# EAGLE design ArduPilotMegaShield_H_v11_filterjumpers (EAGLE 5.11)
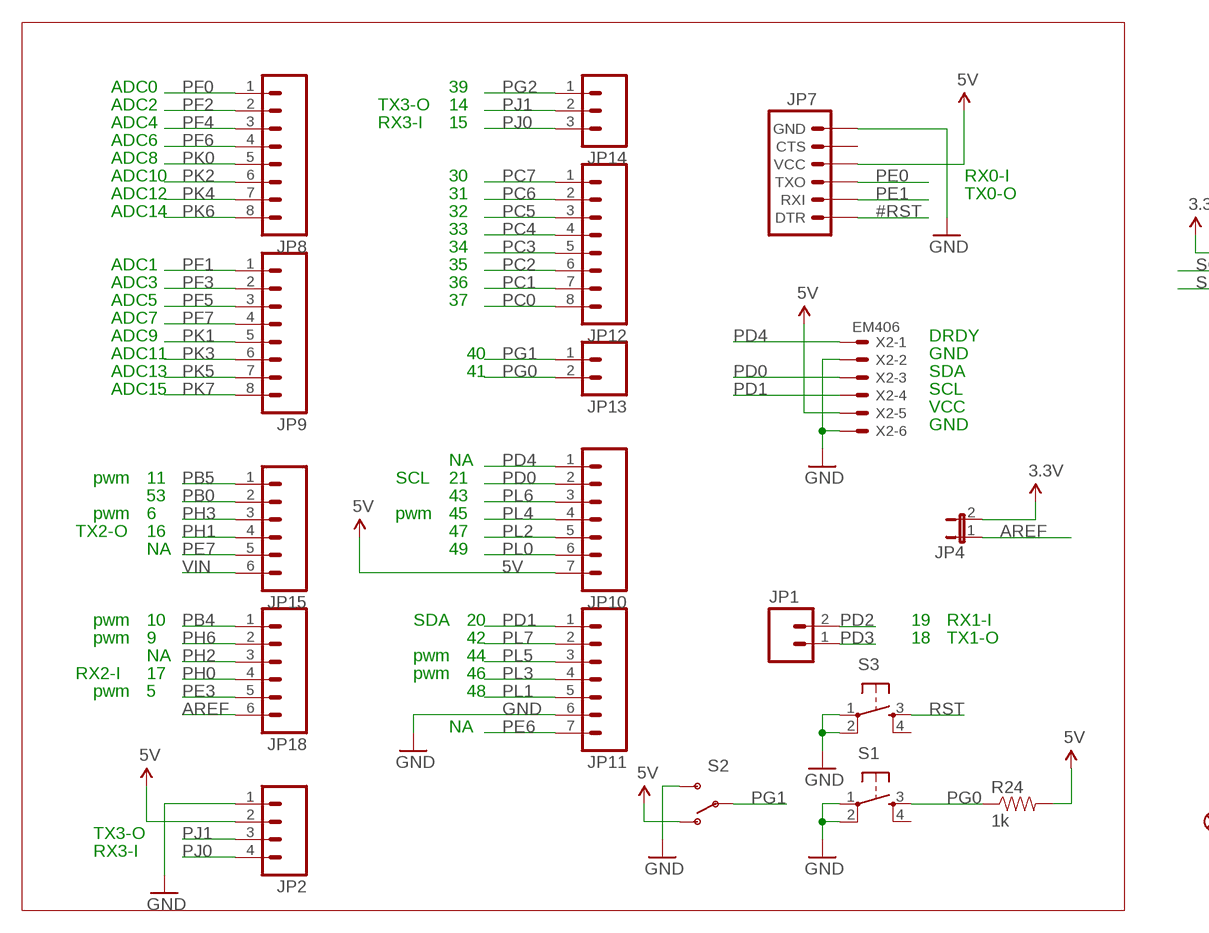
[diagram p0: schematic, sheet 1, part 1 of 2]
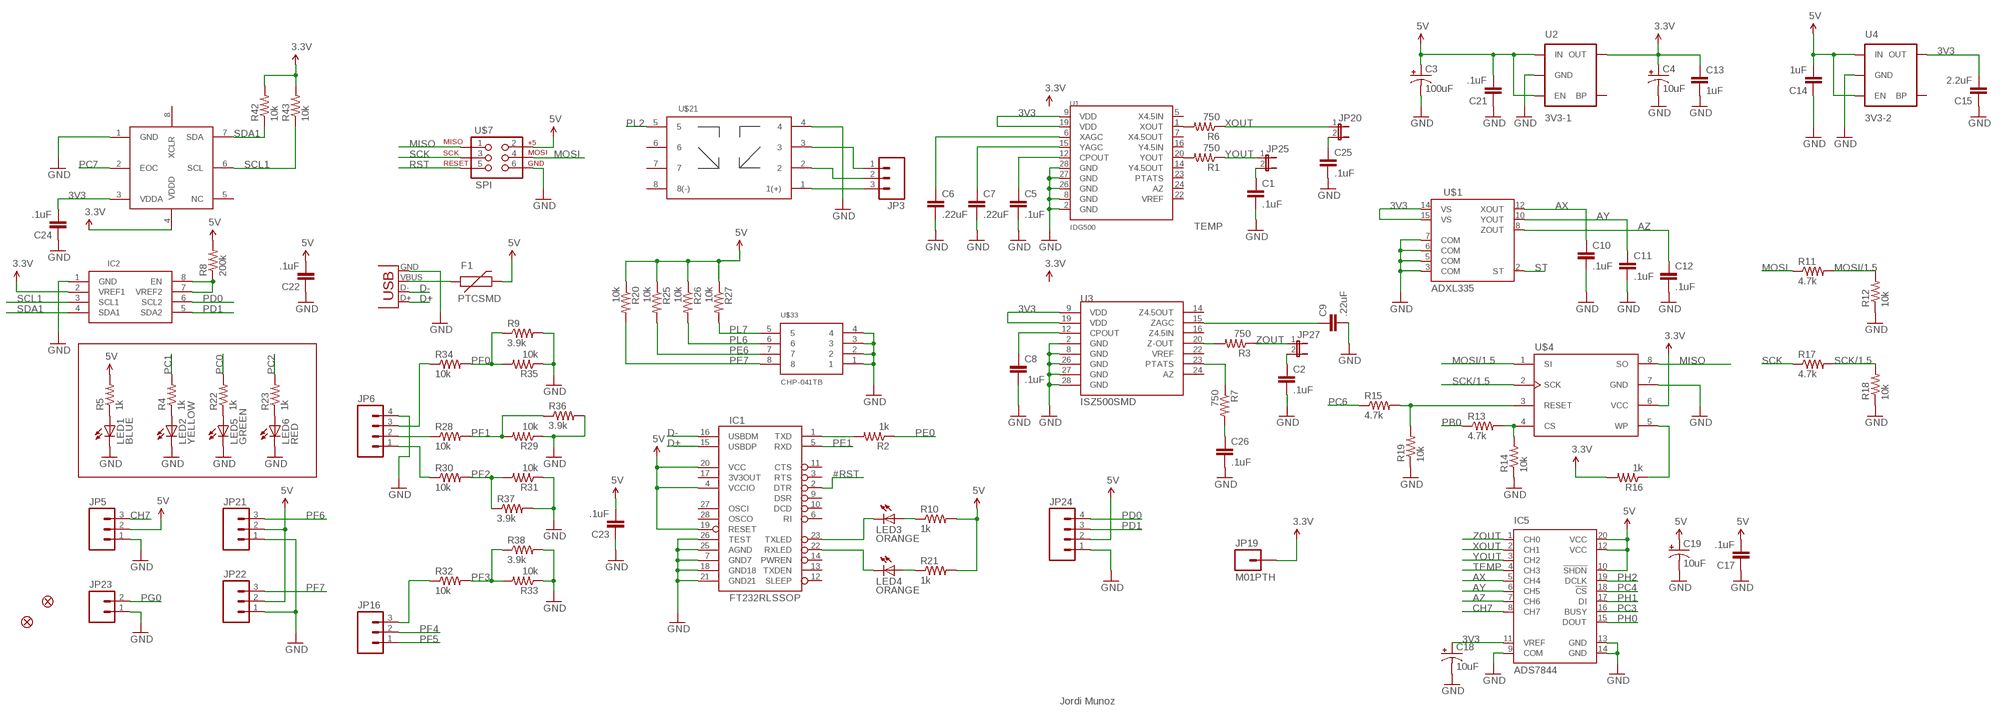
[diagram p1: schematic, sheet 1, part 2 of 2]

## Parts
C1  .1uF  CAP0402  [C0402]
C2  .1uF  CAP0402  [C0402]
C3  100uF  CAP_POL3528  [EIA3528]
C4  10uF  CAP_POL1206  [EIA3216]
C5  .1uF  CAP0402  [C0402]
C6  .22uF  CAP0402  [C0402]
C7  .22uF  CAP0402  [C0402]
C8  .1uF  CAP0402  [C0402]
C9  .22uF  CAP0402  [C0402]
C10  .1uF  CAP0402  [C0402]
C11  .1uF  CAP0402  [C0402]
C12  .1uF  CAP0402  [C0402]
C13  1uF  CAP0402  [C0402]
C14  1uF  CAP0402  [C0402]
C15  2.2uF  CAP0402  [C0402]
C17  .1uF  CAP0402  [C0402]
C18  10uF  CAP_POL1206  [EIA3216]
C19  10uF  CAP_POL1206  [EIA3216]
C21  .1uF  CAP0402  [C0402]
C22  .1uF  CAP0402  [C0402]
C23  .1uF  CAP0402  [C0402]
C24  .1uF  CAP0402  [C0402]
C25  .1uF  CAP0402  [C0402]
C26  .1uF  CAP0402  [C0402]
F1  PTCSMD  [PTC-1206]
IC1  FT232RLSSOP  [SSOP28DB]
IC2  PCA9306  [SOIC8]
IC5  ADS7844  ADS8344U  [SSOP20BU]
JP1  M02PTH  [1X02]
JP2  M04PTH  [1X04]
JP3  M03PTH  [1X03]
JP4  JUMPER-2SMD-NO  [SJ_2S-NO]
JP5  M03PTH  [1X03]
JP6  M04PTH  [1X04]
JP7  ARDUINO_SERIAL_PROGRAMPTH  [1X06]
JP8  M08  [1X08]
JP9  M08  [1X08]
JP10  M07  [1X07]
JP11  M07  [1X07]
JP12  M08  [1X08]
JP13  M02PTH  [1X02]
JP14  M03PTH  [1X03]
JP15  M06SIP  [1X06]
JP16  M03PTH  [1X03]
JP17  FIDUCIAL1X2.5  [FIDUCIAL-1X2.5]
JP18  M06SIP  [1X06]
JP19  M01PTH  [1X01]
JP20  JUMPER-2SMD-NO  [SJ_2S-NO]
JP21  M03PTH  [1X03]
JP22  M03PTH  [1X03]
JP23  M02PTH  [1X02]
JP24  M04PTH  [1X04]
JP25  JUMPER-2SMD-NO  [SJ_2S-NO]
JP26  FIDUCIAL1X2.5  [FIDUCIAL-1X2.5]
JP27  JUMPER-2SMD-NO  [SJ_2S-NO]
LED1  BLUE  LED0603  [LED-0603]
LED2  YELLOW  LED0603  [LED-0603]
LED3  ORANGE  LED0603  [LED-0603]
LED4  ORANGE  LED0603  [LED-0603]
LED5  GREEN  LED0603  [LED-0603]
LED6  RED  LED0603  [LED-0603]
R1  750  RESISTOR0402  [C0402]
R2  1k  RESISTOR0402  [C0402]
R3  750  RESISTOR0402  [C0402]
R4  1k  RESISTOR0402  [C0402]
R5  1k  RESISTOR0402  [C0402]
R6  750  RESISTOR0402  [C0402]
R7  750  RESISTOR0402  [C0402]
R8  200k  RESISTOR0402  [C0402]
R9  3.9k  RESISTOR0402  [C0402]
R10  1k  RESISTOR0402  [C0402]
R11  4.7k  RESISTOR0402  [C0402]
R12  10k  RESISTOR0402  [C0402]
R13  4.7k  RESISTOR0402  [C0402]
R14  10k  RESISTOR0402  [C0402]
R15  4.7k  RESISTOR0402  [C0402]
R16  1k  RESISTOR0402  [C0402]
R17  4.7k  RESISTOR0402  [C0402]
R18  10k  RESISTOR0402  [C0402]
R19  10k  RESISTOR0402  [C0402]
R20  10k  RESISTOR0402  [C0402]
R21  1k  RESISTOR0402  [C0402]
R22  1k  RESISTOR0402  [C0402]
R23  1k  RESISTOR0402  [C0402]
R24  1k  RESISTOR0402  [C0402]
R25  10k  RESISTOR0402  [C0402]
R26  10k  RESISTOR0402  [C0402]
R27  10k  RESISTOR0402  [C0402]
R28  10k  RESISTOR0402  [C0402]
R29  10k  RESISTORPTH1  [AXIAL-0.3]
R30  10k  RESISTOR0402  [C0402]
R31  10k  RESISTORPTH1  [AXIAL-0.3]
R32  10k  RESISTOR0402  [C0402]
R33  10k  RESISTORPTH1  [AXIAL-0.3]
R34  10k  RESISTOR0402  [C0402]
R35  10k  RESISTORPTH1  [AXIAL-0.3]
R36  3.9k  RESISTOR0402  [C0402]
R37  3.9k  RESISTOR0402  [C0402]
R38  3.9k  RESISTOR0402  [C0402]
R42  10k  RESISTOR0402  [C0402]
R43  10k  RESISTOR0402  [C0402]
S1  TAC_SWITCHSMD  [TACTILE_SWITCH_SMD]
S2  SWITCH-SPSTSMD2  [SWITCH-SPDT-SMD]
S3  TAC_SWITCHSMD  [TACTILE_SWITCH_SMD]
U1  IDG500  [QFN-28_6X8]
U2  3V3-1  V_REG_LDOSMD  [SOT23-5]
U3  ISZ500SMD  [QFN-28_6X8]
U4  3V3-2  V_REG_LDOSMD  [SOT23-5]
U$1  ADXL335  ADXL330SMD  [LFCSP-16]
U$4  DF  ATMEL_DATA_FLASH  [SO08WIDE]
U$7  SPI  AVR_SPI_PRG_6NS  [2X3-NS]
U$8  BMP085  [BMP085]
U$21  RELAY_23  [RELAY_23]
U$33  CHP-041TB  [CHP-041TB]
X1  USBSMD  [USB-MINIB]
X2  EM406  SM06B-SRSS-TB  [SM06B-SRSS-TB]

## Nets
3.3V: C4.A(+) C13.1 IC2.2(VREF1) JP4.2 JP19.1 R16.2 R42.2 R43.2 U2.5(OUT) U$4.6(VCC) U$8.4(VDDD)
3V3: C15.2 C18.A(+) C24.2 IC5.11(VREF) U1.9(VDD) U1.19(VDD) U3.9(VDD) U3.19(VDD) U4.5(OUT) U$1.14(VS) U$1.15(VS) U$8.3(VDDA)
5V: C3.A(+) C14.2 C17.2 C19.A(+) C21.2 C22.2 C23.2 F1.2 IC1.4(VCCIO) IC1.19(RESET) IC1.20(VCC) IC5.10(!SHDN) IC5.12(VCC) IC5.20(VCC) JP2.2 JP5.2 JP7.4(VCC) JP10.7 JP21.2 JP22.2 JP24.2 R5.2 R8.2 R10.2 R20.1 R21.2 R24.2 R25.1 R26.1 R27.1 S2.1(O) U2.1(IN) U2.3(EN) U4.1(IN) U4.3(EN) U$7.2 X2.5
#RST: IC1.2(DTR) JP7.1(DTR)
AREF: JP4.1 JP18.6
AX: C10.1 IC5.5(CH4) U$1.12(XOUT)
AY: C11.1 IC5.6(CH5) U$1.10(YOUT)
AZ: C12.1 IC5.7(CH6) U$1.8(ZOUT)
CH7: IC5.8(CH7) JP5.3
D+: IC1.15(USBDP) X1.D+
D-: IC1.16(USBDM) X1.D-
GND: C1.2 C2.2 C3.C(-) C4.C(-) C5.2 C6.2 C7.2 C8.2 C9.2 C10.2 C11.2 C12.2 C13.2 C14.1 C15.1 C17.1 C18.C(-) C19.C(-) C21.1 C22.1 C23.1 C24.1 C25.2 C26.2 IC1.7(GND7) IC1.18(GND18) IC1.21(GND21) IC1.25(AGND) IC1.26(TEST) IC2.1(GND) IC5.9(COM) IC5.13(GND) IC5.14(GND) JP2.1 JP5.1 JP6.4 JP7.6(GND) JP11.6 JP21.1 JP22.1 JP23.1 JP24.1 LED1.C LED2.C LED5.C LED6.C R9.2 R12.1 R14.1 R18.1 R19.1 R29.P$1 R31.P$1 R33.P$1 R35.P$1 R36.2 R37.2 R38.2 S1.1 S1.2 S2.3(S) S3.1 S3.2 U1.2(GND) U1.8(GND) U1.26(GND) U1.27(GND) U1.28(GND) U2.2(GND) U3.2(GND) U3.8(GND) U3.26(GND) U3.27(GND) U3.28(GND) U4.2(GND) U$1.3(COM) U$1.5(COM) U$1.6(COM) U$1.7(COM) U$4.7(GND) U$7.6 U$8.1(GND) U$21.4 U$33.1 U$33.2 U$33.3 U$33.4 X1.GND X2.2 X2.6
MISO: U$4.8(SO) U$7.1
MOSI: R11.1 U$7.4
MOSI/1.5: R11.2 R12.2 U$4.1(SI)
N$1: LED1.A R5.1
N$2: LED2.A R4.1
N$3: C8.1 U3.12(CPOUT)
N$4: C9.1 U3.15(ZAGC)
N$5: LED3.A R10.1
N$6: IC1.1(TXD) R2.2
N$7: R15.2 R19.2 U$4.3(RESET)
N$8: R3.2 U3.20(Z-OUT)
N$9: R7.1 U3.23(PTATS)
N$10: IC2.7(VREF2) IC2.8(EN) R8.1
N$11: JP3.1 U$21.3
N$12: R1.2 U1.20(YOUT)
N$13: C6.1 U1.6(XAGC)
N$14: R13.2 R14.2 U$4.4(CS)
N$15: R6.2 U1.1(XOUT)
N$16: C5.1 U1.12(CPOUT)
N$17: F1.1 X1.VBUS
N$18: C7.1 U1.15(YAGC)
N$20: C2.1 JP27.2
N$21: JP3.2 U$21.2
N$22: LED4.A R21.1
N$23: C25.1 JP20.2
N$24: IC1.23(TXLED) LED3.C
N$25: IC1.22(RXLED) LED4.C
N$26: LED5.A R22.1
N$27: LED6.A R23.1
N$28: JP3.3 U$21.1(1(+))
N$29: C1.1 JP25.2
N$34: JP6.2 R28.1
N$36: JP6.1 R30.1
N$38: JP16.3 R32.1
N$40: JP6.3 R34.1
PB0: JP15.2 R13.1
PB4: JP18.1
PB5: JP15.1
PC0: JP12.8 R22.2
PC1: JP12.7 R4.2
PC2: JP12.6 R23.2
PC3: IC5.16(BUSY) JP12.5
PC4: IC5.18(!CS) JP12.4
PC5: JP12.3
PC6: JP12.2 R15.1
PC7: JP12.1 U$8.2(EOC)
PD0: IC2.6(SCL2) JP10.2 JP24.4 X2.3
PD1: IC2.5(SDA2) JP11.1 JP24.3 X2.4
PD2: JP1.2
PD3: JP1.1
PD4: JP10.1 X2.1
PE0: JP7.3(TXO) R2.1
PE1: IC1.5(RXD) JP7.2(RXI)
PE3: JP18.5
PE6: JP11.7 R25.2 U$33.7
PE7: JP15.5 R20.2 U$33.8
PF0: JP8.1 R9.1 R34.2 R35.P$2
PF1: JP9.1 R28.2 R29.P$2 R36.1
PF2: JP8.2 R30.2 R31.P$2 R37.1
PF3: JP9.2 R32.2 R33.P$2 R38.1
PF4: JP8.3 JP16.2
PF5: JP9.3 JP16.1
PF6: JP8.4 JP21.3
PF7: JP9.4 JP22.3
PG0: JP13.2 JP23.2 R24.1 S1.3
PG1: JP13.1 S2.2(P)
PG2: JP14.1
PH0: IC5.15(DOUT) JP18.4
PH1: IC5.17(DI) JP15.4
PH2: IC5.19(DCLK) JP18.3
PH3: JP15.3
PH6: JP18.2
PJ0: JP2.4 JP14.3
PJ1: JP2.3 JP14.2
PK0: JP8.5
PK1: JP9.5
PK2: JP8.6
PK3: JP9.6
PK4: JP8.7
PK5: JP9.7
PK6: JP8.8
PK7: JP9.8
PL0: JP10.6
PL1: JP11.5
PL2: JP10.5 U$21.5
PL3: JP11.4
PL4: JP10.4
PL5: JP11.3
PL6: JP10.3 R26.2 U$33.6
PL7: JP11.2 R27.2 U$33.5
RST: S3.3 U$7.5
SCK: R17.1 U$7.3
SCK/1.5: R17.2 R18.2 U$4.2(SCK)
SCL1: IC2.3(SCL1) R43.1 U$8.6(SCL)
SDA1: IC2.4(SDA1) R42.1 U$8.7(SDA)
ST: U$1.2(ST)
TEMP: C26.1 IC5.4(CH3) R7.2
VIN: JP15.6
WP: R16.1 U$4.5(WP)
XOUT: IC5.2(CH1) JP20.1 R6.1
YOUT: IC5.3(CH2) JP25.1 R1.1
ZOUT: IC5.1(CH0) JP27.1 R3.1
Unconnected: IC1.3(RTS) IC1.6(RI) IC1.9(DSR) IC1.10(DCD) IC1.11(CTS) IC1.12(SLEEP) IC1.13(TXDEN) IC1.14(PWREN) IC1.17(3V3OUT) IC1.27(OSCI) IC1.28(OSCO) JP7.5(CTS) S1.4 S3.4 U1.5(X4.5IN) U1.7(X4.5OUT) U1.14(Y4.5OUT) U1.16(Y4.5IN) U1.22(VREF) U1.23(PTATS) U1.24(AZ) U2.4(BP) U3.14(Z4.5OUT) U3.16(Z4.5IN) U3.22(VREF) U3.24(AZ) U4.4(BP) U$8.5(NC) U$8.8(XCLR) U$21.6 U$21.7

## Notes on the sheet
- ADC0 | 39
- ADC2 | TX3-O | 14
- ADC4 | RX3-I | 15
- ADC6
- ADC8
- ADC10 | 30 | RX0-I
- ADC12 | 31 | TX0-O
- ADC14 | 32
- 33
- 34
- ADC1 | 35
- ADC3 | 36
- ADC5 | 37
- ADC7
- ADC9 | DRDY
- ADC11 | 40 | GND
- ADC13 | 41 | SDA
- ADC15 | SCL
- VCC
- GND
- NA
- pwm | 11 | SCL | 21
- 53 | 43
- pwm | 6 | pwm | 45
- TX2-O | 16 | 47
- NA | 49
- pwm | 10 | SDA | 20 | 19 | RX1-I
- pwm | 9 | 42 | 18 | TX1-O
- NA | pwm | 44
- RX2-I | 17 | pwm | 46
- pwm | 5 | 48
- NA
- TX3-O
- RX3-I
- Jordi Munoz

## Power pins joined to a net without a drawn wire
8(-): U$21.8(8(-))

## Library data of the parts
C1 C2 C5-C15 C17 C21-C26 = DIYdrones3:CAP: Capacitor Standard 0603 ceramic capacitor, and 0.1" leaded capacitor.
C3 C4 C18 C19 = DIYdrones3:CAP_POL: Capacitor Polarized These are standard SMD and PTH capacitors. Normally 10uF, 47uF, and 100uF in electrolytic and tantalum varieties. Always verify the external diameter of the through hole cap, it varies with capacity, voltage, and manufacturer. The EIA devices should be standard.
F1 = DIYdrones3:PTC: Resettable Fuse PTC Resettable Fuse. Spark Fun Electronics SKU : COM-08357
IC1 = SparkFun:FT232RL: USB UART FT232RL 4th Generation USB UART (USB <-> Serial) Controller. Spark Fun Electronics SKU : COM-00650
IC2 = DIYdrones:PCA9306: I2C Level translator. Digi-Key part: 568-4215-1-ND By Jordi Munoz
IC5 = burr-brown:ADS8344: 16-Bit, 8-Channel Serial Output Sampling ADC
JP1 JP13 JP23 = DIYdrones3:M02: Header 2 Standard 2-pin 0.1" header. Use with straight break away headers (SKU : PRT-00116), right angle break away headers (PRT-00553), swiss pins (PRT-00743), machine pins (PRT-00117), and female headers (PRT-00115). Molex polarized connector foot print use with SKU : PRT-08233 with associated crimp pins and housings.
JP2 JP6 JP24 = DIYdrones3:M04: Header 4 Standard 4-pin 0.1" header. Use with straight break away headers (SKU : PRT-00116), right angle break away headers (PRT-00553), swiss pins (PRT-00743), machine pins (PRT-00117), and female headers (PRT-00115). Molex polarized connector foot print use with SKU : PRT-08231 with associated crimp pins and housings.
JP3 JP5 JP14 JP16 JP21 JP22 = DIYdrones3:M03: Header 3 Standard 3-pin 0.1" header. Use with straight break away headers (SKU : PRT-00116), right angle break away headers (PRT-00553), swiss pins (PRT-00743), machine pins (PRT-00117), and female headers (PRT-00115). Molex polarized connector foot print use with SKU : PRT-08232 with associated crimp pins and housings.
JP4 JP20 JP25 JP27 = DIYdrones3:JUMPER-2: Jumper Basic 0.1" spaced jumper. Use with breakaway headers.
JP7 = DIYdrones3:ARDUINO_SERIAL_PROGRAM
JP8 JP9 JP12 = DIYdrones3:M08: Header 8 Standard 8-pin 0.1" header. Use with straight break away headers (SKU : PRT-00116), right angle break away headers (PRT-00553), swiss pins (PRT-00743), machine pins (PRT-00117), and female headers (PRT-00115).
JP10 JP11 = DIYdrones3:M07: Header 7 Standard 7-pin 0.1" header. Use with straight break away headers (SKU : PRT-00116), right angle break away headers (PRT-00553), swiss pins (PRT-00743), machine pins (PRT-00117), and female headers (PRT-00115). NOTES ON THE VARIANTS LOCK and LOCK_LONGPADS... This footprint was designed to help hold the alignment of a through-hole component (i.e. 7-pin header) while soldering it into place. You may notice that each hole has been shifted either up or down by 0.005 of an inch from it's more standard position (which is usually a perfectly straight line). This slight alteration caused the pins (the squares in the middle) to touch the edges of the holes. Because they are alternating, it causes a "brace" to hold the header in place. 0.005 has proven to be the perfect amount of "off-center" position when using our standard breakaway headers. Although looks a little odd when you look at the bare footprint, once you have a header in there, the alteration is very hard to notice. Also, if you push a header all the way into place, it is covered up entirely on the bottom side. This idea of altering the position of holes to aid alignment will be further integrated into the Sparkfun Library for other footprints. It can help hold any component with 3 or more connection pins.
JP15 JP18 = DIYdrones3:M06: Header 6 Standard 6-pin 0.1" header. Use with straight break away headers (SKU : PRT-00116), right angle break away headers (PRT-00553), swiss pins (PRT-00743), machine pins (PRT-00117), and female headers (PRT-00115). Molex polarized connector foot print use with SKU : PRT-08094 with associated crimp pins and housings. NOTES ON THE VARIANTS LOCK and LOCK_LONGPADS... This footprint was designed to help hold the alignment of a through-hole component (i.e. 6-pin header) while soldering it into place. You may notice that each hole has been shifted either up or down by 0.005 of an inch from it's more standard position (which is a perfectly straight line). This slight alteration caused the pins (the squares in the middle) to touch the edges of the holes. Because they are alternating, it causes a "brace" to hold the component in place. 0.005 has proven to be the perfect amount of "off-center" position when using our standard breakaway headers. Although looks a little odd when you look at the bare footprint, once you have a header in there, the alteration is very hard to notice. Also, if you push a header all the way into place, it is covered up entirely on the bottom side. This idea of altering the position of holes to aid alignment will be further integrated into the Sparkfun Library for other footprints. It can help hold any component with 3 or more connection pins.
JP17 JP26 = SparkFun:FIDUCIAL: Fiducial Alignment Points Various fiducial points for machine vision alignment.
JP19 = DIYdrones3:M01: Header 1 Standard 1-pin 0.1" header. Use with straight break away headers (SKU : PRT-00116), right angle break away headers (PRT-00553), swiss pins (PRT-00743), machine pins (PRT-00117), and female headers (PRT-00115).
LED1-LED6 = DIYdrones3:LED: LEDs Standard schematic elements and footprints for 5mm, 3mm, 1206, and 0603 sized LEDs. 5mm - Spark Fun Electronics SKU : COM-00529 (and others)
R1-R38 R42 R43 = DIYdrones3:RESISTOR: Resistor Basic schematic elements and footprints for 0603, 1206, and PTH 1/10th watt (small) resistors.
S1 S3 = DIYdrones3:TAC_SWITCH: Momentary Switch Button commonly used for reset or general input. Spark Fun Electronics SKU : COM-00097
S2 = SparkFun:SWITCH-SPST: SPST Switch Simple slide switch. Spark Fun Electronics SKU : COM-00102
U1 = DIYdrones_112210:IDG500
U2 U4 = SparkFun:V_REG_LDO: Voltage Regulator LDO Standard 150mA LDO voltage regulator in SOT-23 layout. Micrel part MIC5205. BP (by-pass) pin is used to lower output noise with 470pF cap.
U3 = DIYdrones_112210:ISZ500: ISZ500 Single axis gyro
U$1 = DIYdrones3:ADXL330: Triple Axis Accelerometer Analog Devices ADXL330 +/-3g 2.4V-5.25V Analog output. Spark Fun Electronics SKU : COM-00730. Center pad paste layer has been reduced to avoid shorting.
U$4 = DIYdrones3:ATMEL_DATA_FLASH: 16Mbit EEPROM DataFlash Footprint needs touching up. Spark Fun Electronics SKU : COM-00301
U$7 = DIYdrones3:AVR_SPI_PRG_6: AVR ISP 6 Pin This is the reduced ISP connector for AVR programming. Common on Arduino. This footprint will take up less PCB space and can be used with a 10-pin to 6-pin adapter such as SKU: BOB-08508
U$8 = SparkFun:BMP085
U$21 = DIYdrones:RELAY_23
U$33 = DIYdrones:CHP-041TB: By Jordi Munoz, for DIYDrones.com (3DRRobotics LLC).
X1 = DIYdrones3:USB: USB Connectors USB-B-PTH is fully proven SKU : PRT-00139 USB-miniB is fully proven SKU : PRT-00587 USB-A-PCB is untested. USB-A-H is throughly reviewed, but untested. Spark Fun Electronics SKU : PRT-00437 USB-B-SMT is throughly reviewed, but untested. Needs silkscreen touching up. USB-A-S has not been used/tested USB-MB-H has not been used/tested
X2 = con-jst2:?M06B-SRSS-TB: Disconnectable Crimp style connector, 1.0mm pitch 6 contacts

## Board
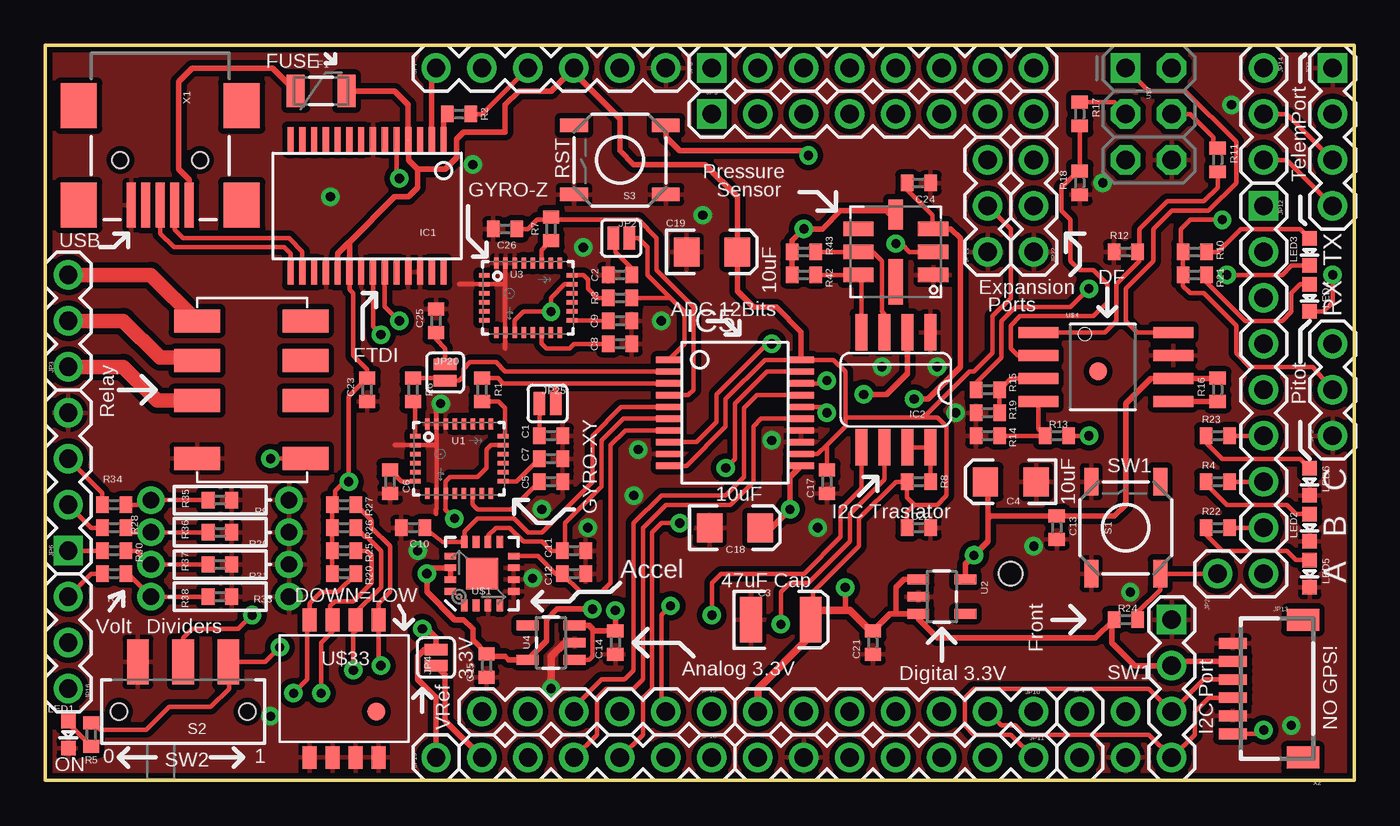
[diagram p2: board, top side]
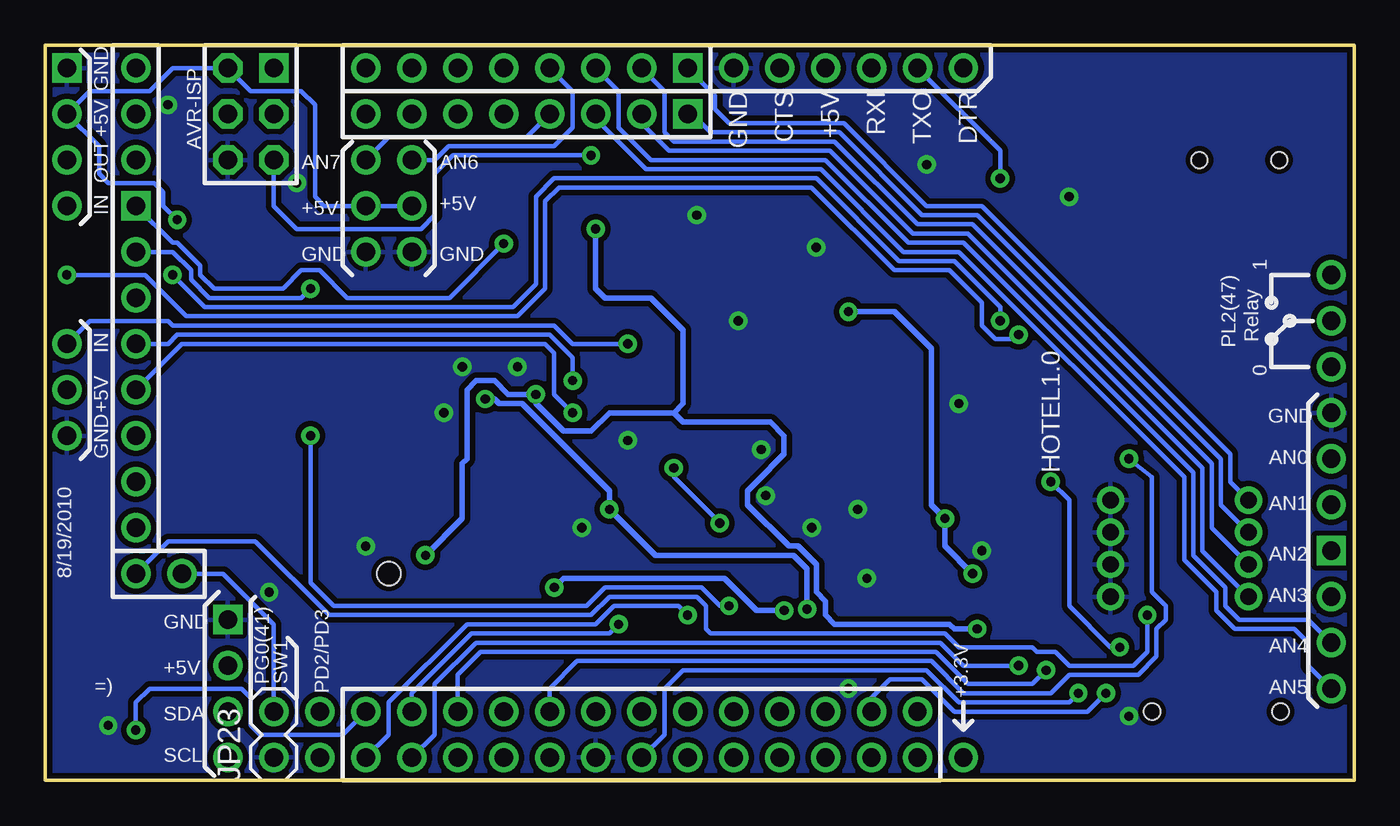
[diagram p3: board, bottom side, seen from below]

Size 72.31 x 40.63 mm. Coordinates in mm from the lower left corner, seen from the top.
Outline: 0,0 72.31,0 72.31,40.63 0,40.63 0,0
Copper layers (1*16): Top 0.035mm / dielectric 1.5mm / Bottom 0.035mm
Design rules "SparkFun": minimum track width 8mil, minimum drill 20mil, track to track 8mil, track to pad 8mil, pad to pad 8mil, via to via 8mil, smd to smd 8mil, copper to edge 10mil, drill to drill 8mil, minimum pad ring 12mil, minimum via ring 10mil, stop-mask expansion 4mil, vias tented up to drill 25mil, thermal gap 10mil
Holes 1.3 mm at 53.34,11.43

### Footprints (pad centres in the part's own frame; a part is rotated, then mirrored left to right if it is on the bottom)
C0402 = smd 0.7 x 0.9: 1 -0.65,0; 2 0.65,0
EIA3528 = smd 1.2 x 2.5: A 1.65,0; C -1.65,0
EIA3216 = smd 1.4 x 1.6: A 1.4,0; C -1.4,0
PTC-1206 = smd 1 x 1.8: 1 -1.4,0; 2 1.4,0
SSOP28DB = smd 0.348 x 1.397: 1 -4.225,-3.656; 2 -3.575,-3.656; 3 -2.925,-3.656; 4 -2.275,-3.656; 5 -1.625,-3.656; 6 -0.975,-3.656; 7 -0.325,-3.656; 8 0.325,-3.656; 9 0.975,-3.656; 10 1.625,-3.656; 11 2.275,-3.656; 12 2.925,-3.656; 13 3.575,-3.656; 14 4.225,-3.656; 15 4.225,3.656; 16 3.575,3.656; 17 2.925,3.656; 18 2.275,3.656; 19 1.625,3.656; 20 0.975,3.656; 21 0.325,3.656; 22 -0.325,3.656; 23 -0.975,3.656; 24 -1.625,3.656; 25 -2.275,3.656; 26 -2.925,3.656; 27 -3.575,3.656; 28 -4.225,3.656
SOIC8 = smd 0.66 x 2.032: 1 -1.905,-3.175; 2 -0.635,-3.175; 3 0.635,-3.175; 4 1.905,-3.175; 5 1.905,3.175; 6 0.635,3.175; 7 -0.635,3.175; 8 -1.905,3.175
SSOP20BU = smd 0.348 x 1.397: 1 -2.925,-3.656; 2 -2.275,-3.656; 3 -1.625,-3.656; 4 -0.975,-3.656; 5 -0.325,-3.656; 6 0.325,-3.656; 7 0.975,-3.656; 8 1.625,-3.656; 9 2.275,-3.656; 10 2.925,-3.656; 11 2.925,3.656; 12 2.275,3.656; 13 1.625,3.656; 14 0.975,3.656; 15 0.325,3.656; 16 -0.325,3.656; 17 -0.975,3.656; 18 -1.625,3.656; 19 -2.275,3.656; 20 -2.925,3.656
1X02 = drill 1.016 round: 1 0,0; 2 2.54,0
1X04 = drill 1.016 square: 1 0,0 | drill 1.016 round: 2 2.54,0; 3 5.08,0; 4 7.62,0
1X03 = drill 1.016 round: 1 0,0; 2 2.54,0; 3 5.08,0
SJ_2S-NO = smd 0.635 x 1.27: 1 0,0; 2 0.889,0
1X06 = drill 1.016 round: 1 0,0; 2 2.54,0; 3 5.08,0; 4 7.62,0; 5 10.16,0; 6 12.7,0
1X08 = drill 1.016 square: 1 0,0 | drill 1.016 round: 2 2.54,0; 3 5.08,0; 4 7.62,0; 5 10.16,0; 6 12.7,0; 7 15.24,0; 8 17.78,0
1X07 = drill 1.016 round: 1 0,0; 2 2.54,0; 3 5.08,0; 4 7.62,0; 5 10.16,0; 6 12.7,0; 7 15.24,0
FIDUCIAL-1X2.5 = smd 1 x 1: 1 0,0
1X01 = drill 1.016 round: 1 0,0
LED-0603 = smd 0.8 x 0.8: A 0,-0.75; C 0,0.75
AXIAL-0.3 = drill 0.9 round: P$1 -3.81,0; P$2 3.81,0
TACTILE_SWITCH_SMD = smd 1.524 x 0.762: 1 -2.54,1.905; 2 2.54,1.905; 3 -2.54,-1.905; 4 2.54,-1.905
SWITCH-SPDT-SMD = smd 1.2 x 2.5: 1 -2.5,-2.75; 2 0,-2.75; 3 2.5,-2.75 | hole 0.9: -3.55,0; 3.55,0
QFN-28_6X8 = smd 0.6 x 0.25: 1 -2.417,1.25; 2 -2.417,0.75; 3 -2.417,0.25; 4 -2.417,-0.25; 5 -2.417,-0.75; 6 -2.417,-1.25; 15 2.433,-1.25; 16 2.433,-0.75; 17 2.433,-0.25; 18 2.433,0.25; 19 2.433,0.75; 20 2.433,1.25 | smd 0.25 x 0.6: 7 -1.742,-1.925; 8 -1.242,-1.925; 9 -0.742,-1.925; 10 -0.242,-1.925; 11 0.258,-1.925; 12 0.758,-1.925; 13 1.258,-1.925; 14 1.758,-1.925; 21 1.758,1.925; 22 1.258,1.925; 23 0.758,1.925; 24 0.258,1.925; 25 -0.242,1.925; 26 -0.742,1.925; 27 -1.242,1.925; 28 -1.742,1.925
SOT23-5 = smd 0.55 x 1.2: 1 -0.95,-1.3; 2 0,-1.3; 3 0.95,-1.3; 4 0.95,1.3; 5 -0.95,1.3
LFCSP-16 = smd 1.75 x 1.75: 0 0,0 | smd 0.65 x 0.37: 1 -1.75,0.975; 2 -1.75,0.325; 3 -1.75,-0.325; 4 -1.75,-0.975; 9 1.75,-0.975; 10 1.75,-0.325; 11 1.75,0.325; 12 1.75,0.975 | smd 0.37 x 0.65: 5 -0.975,-1.75; 6 -0.325,-1.75; 7 0.325,-1.75; 8 0.975,-1.75; 13 0.975,1.75; 14 0.325,1.75; 15 -0.325,1.75; 16 -0.975,1.75
SO08WIDE = smd 0.61 x 2.21: 1 -1.905,-3.569; 2 -0.635,-3.569; 3 0.635,-3.569; 4 1.905,-3.569; 5 1.905,3.886; 6 0.635,3.886; 7 -0.635,3.886; 8 -1.905,3.886
2X3-NS = drill 1.016 square: 1 -2.54,-1.27 | drill 1.016 octagon: 2 -2.54,1.27; 3 0,-1.27; 4 0,1.27; 5 2.54,-1.27; 6 2.54,1.27
BMP085 = smd 1.67 x 0.8: 1 -2.065,1.27; 2 -2.065,0; 3 -2.065,-1.27; 5 2.065,-1.27; 6 2.065,0; 7 2.065,1.27 | smd 0.8 x 1.67: 4 0,-2.065 | smd 0.8 x 2.5: 8 0,1.65
RELAY_23 = smd 1.27 x 2.54: 1 3.806,3.048; 2 1.606,3.048; 3 -0.594,3.048; 4 -3.794,3.048; 5 -3.794,-2.952; 6 -0.594,-2.952; 7 1.606,-2.952; 8 3.806,-2.952
CHP-041TB = smd 0.76 x 1.27: 1 -1.905,-3.81; 2 -0.635,-3.81; 3 0.635,-3.81; 4 1.905,-3.81; 5 1.905,3.81; 6 0.635,3.81; 7 -0.635,3.81; 8 -1.905,3.81
USB-MINIB = smd 2.5 x 0.5: D+ 2.5,0; D- 2.5,0.8; GND 2.5,-1.6; ID 2.5,-0.8; VBUS 2.5,1.6 | smd 2.5 x 2: GND@1 -3,-4.5; GND@2 -3,4.5; GND@3 2.5,4.5; GND@4 2.5,-4.5 | hole 0.9: 0,2.2; 0,-2.2
SM06B-SRSS-TB = smd 0.6 x 1.55: 1 -2.5,2.975; 2 -1.5,2.975; 3 -0.5,2.975; 4 0.5,2.975; 5 1.5,2.975; 6 2.5,2.975 | smd 1.2 x 1.8: FIT@1 -3.8,-0.9; FIT@2 3.8,-0.9

### Placement (x,y rotation side)
C1  27.94,19.05 0 top
C2  31.75,27.94 180 top
C3  40.64,8.89 0 top
C4  53.34,16.51 180 top
C5  27.94,16.51 0 top
C6  19.05,16.51 270 top
C7  27.94,17.78 0 top
C8  31.75,24.13 0 top
C9  31.75,25.4 0 top
C10  20.32,13.97 180 top
C11  29.21,12.7 0 top
C12  29.21,11.43 0 top
C13  55.88,13.97 270 top
C14  31.5,7.62 90 top
C15  24.38,6.35 90 top
C17  43.18,16.51 90 top
C18  38.1,13.97 0 top
C19  36.83,29.21 0 top
C21  45.72,7.62 90 top
C22  48.26,13.97 180 top
C23  17.78,21.59 90 top
C24  48.26,33.02 180 top
C25  21.59,25.4 90 top
C26  25.4,30.48 180 top
F1  15.24,38.1 0 top
IC1  17.78,31.75 180 top
IC2  46.99,21.59 180 top
IC5  38.1,20.32 270 top
JP1  57.15,3.81 270 top
JP2  71.12,39.37 270 top
JP3  1.27,22.86 90 top
JP4  21.59,6.35 90 top
JP5  71.12,19.05 90 top
JP6  1.27,12.7 90 top
JP7  21.59,39.37 0 top
JP8  36.83,39.37 0 top
JP9  36.83,36.83 0 top
JP10  54.61,3.81 180 top
JP11  54.61,1.27 180 top
JP12  67.31,31.75 270 top
JP13  67.31,11.43 180 top
JP14  67.31,39.37 270 top
JP15  36.83,3.81 180 top
JP16  1.27,5.08 90 top
JP17  18.29,3.81 0 top
JP18  36.83,1.27 180 top
JP19  21.59,1.27 0 top
JP20  22.1,22.1 90 top
JP21  52.07,29.21 90 top
JP22  54.61,29.21 90 top
JP23  59.69,1.27 90 bottom
JP24  62.23,8.89 270 top
JP25  28.19,20.83 180 top
JP26  58.17,22.61 0 top
JP27  32.26,29.97 180 top
LED1  1.27,2.54 180 top
LED2  69.85,13.97 180 top
LED3  69.85,29.21 180 top
LED4  69.85,26.67 180 top
LED5  69.85,11.43 180 top
LED6  69.85,16.51 180 top
R1  24.13,21.59 270 top
R2  22.86,36.83 180 top
R3  31.75,26.67 180 top
R4  64.77,16.51 0 top
R5  2.54,2.54 90 top
R6  20.32,21.59 270 top
R7  27.94,30.48 90 top
R8  48.26,16.51 180 top
R9  9.65,15.49 0 top
R10  63.5,29.21 180 top
R11  64.77,34.29 270 top
R12  59.69,29.21 0 top
R13  55.88,19.05 180 top
R14  52.07,19.05 0 top
R15  52.07,21.59 0 top
R16  64.77,21.59 90 top
R17  57.15,36.83 270 top
R18  57.15,33.02 90 top
R19  52.07,20.32 0 top
R20  16.51,11.43 0 top
R21  63.5,27.94 180 top
R22  64.77,13.97 0 top
R23  64.77,19.05 0 top
R24  59.69,8.89 180 top
R25  16.51,12.7 0 top
R26  16.51,13.97 0 top
R27  16.51,15.24 0 top
R28  3.81,13.97 0 top
R29  9.65,13.72 180 top
R30  3.81,12.7 0 top
R31  9.65,11.94 180 top
R32  3.81,11.43 0 top
R33  9.65,10.16 180 top
R34  3.81,15.24 0 top
R35  9.65,15.49 180 top
R36  9.65,13.72 0 top
R37  9.65,11.94 0 top
R38  9.65,10.16 0 top
R42  41.91,27.94 180 top
R43  41.91,29.21 180 top
S1  59.69,13.97 90 top
S2  7.62,3.81 180 top
S3  31.75,34.29 180 top
U1  22.86,17.78 0 top
U2  49.53,10.16 270 top
U3  26.67,26.67 0 top
U4  27.94,7.62 90 top
U$1  24.13,11.43 90 top
U$4  58.42,22.86 270 top
U$7  60.96,36.83 270 top
U$8  46.99,29.21 180 top
U$21  11.43,21.59 90 top
U$33  16.51,5.08 0 top
X1  6.35,34.29 270 top
X2  68.58,5.08 90 top

### Tracks (layer width: path | path; a pad name or v marks a point on that pad's centre or on a via)
3.3V  (via drill 0.51)
  Top 0.254: 64.75,22.23 R16.2 | 20.95,7.24 JP4.2 | 21.08,8.38 v20.83,8.38 | 46.7,31.27 U$8.4
  Top 0.305: 64.75,22.23 U$4.6 61.09,22.23 59.69,20.83 59.69,15.24 59.07,14.62 C13.1 52.21,14.62 52.07,14.48 | v45.21,21.34 46.48,21.34 47.62,22.48 IC2.2 | R42.2 R43.2 41.26,29.83 v41.91,30.48 42.93,30.48 43.94,31.5 46.48,31.5 46.7,31.27 | JP19.1 21.59,4.57 20.57,5.59 20.57,6.86 20.95,7.24 | 52.07,14.48 52.07,16.38 | 52.07,14.48 52.07,13.21 v51.31,12.45 50.83,11.97 U2.5 | JP4.2 21.59,7.87 21.08,8.38
  Top 0.406: 52.07,16.38 C4.A
  Bottom 0.305: v41.91,30.48 41.91,27.18 41.4,26.67 38.86,26.67 37.08,24.89 37.08,20.83 37.59,20.32 | v51.31,12.45 49.28,14.48 49.28,17.53 49.02,17.78 49.02,21.59 48.51,22.1 47.5,22.1 46.74,21.34 v45.21,21.34 45.21,20.83 43.69,19.3 42.16,19.3 41.15,20.32 37.59,20.32 | v20.83,8.38 22.1,8.38 22.35,8.64 28.7,8.64 29.21,9.14 29.21,9.91 29.72,10.41 29.72,11.94 30.73,12.95 31.24,12.95 33.53,15.24 33.53,16 33.02,16.51 31.5,18.03 31.5,19.05 32.26,19.81 37.08,19.81 37.59,20.32
3V3  (via drill 0.51)
  Top 0.254: U3.9 25.93,25.42 26.42,25.91 v27.94,25.91 27.94,26.67 28.69,27.42 U3.19 | U1.19 24.63,18.53 24.38,18.29 24.38,17.27 23.88,16.76 22.35,16.76 22.12,16.53 U1.9 22.12,15.01 22.1,14.99 v22.61,14.48 | 25.4,6.86 25.59,6.67 | C15.2 24.53,6.86 | C24.2 47.61,32.65 49.02,31.24 49.02,30.51 U$8.3
  Top 0.305: U$1.15 U$1.14 21.41,11.76 v21.08,11.43 21.08,10.41 22.61,8.89 23.11,8.89 23.62,8.38 23.62,7.76 C15.2 | 25.59,6.67 U4.5 27.69,7.72 27.69,8.89 28.27,9.47 v30.23,9.47 | 24.53,6.86 25.4,6.86 | C18.A 40.13,13.97 v41.15,14.99 41.15,16.79 IC5.11 | U$8.3 50.04,30.48 50.55,29.97 50.55,22.86 48.77,21.08 v48.01,21.08
  Bottom 0.305: v21.08,11.43 22.61,12.95 v22.61,14.48 23.37,15.24 23.37,23.88 25.4,25.91 v27.94,25.91 | v30.23,9.47 30.23,11.68 30.99,12.45 38.61,12.45 v41.15,14.99 41.15,16 45.97,20.83 47.24,20.83 47.5,21.08 v48.01,21.08
5V  (via drill 0.51)  (1 unrouted)
  Top 0.254: IC5.12 42.02,18.03 42.67,18.03 43.18,18.54 | IC5.10 35.43,17.39 37.59,19.56 37.59,21.08 39.76,23.25 IC5.20 43.56,23.25 44.2,22.61 44.2,20.07 | 44.2,20.07 44.2,19.56 43.18,18.54 | 43.18,18.54 C17.2 | 16.8,29.76 16.76,29.72 16.8,29.68 | JP5.2 70.06,22.82 70.03,22.86 66.55,22.86 65.79,23.62 65.79,25.15 64.01,26.92 63.25,26.92 62.85,27.32 R21.2 R10.2 62.74,29.32 62.74,30.48 63.25,30.99 v65.02,30.99 | v12.95,7.37 12.15,6.56 S2.1 10.16,6.52 10.16,5.08 9.14,4.06 6.86,4.06 5.59,2.79 3.05,2.79 2.65,3.19 R5.2 | 16,11.29 R20.1 R25.1 R26.1 R27.1 16,15.38 16,16 16.51,16.51 v16.76,16.51 16.76,21.22 C23.2 17.78,22.72 17.02,23.48 17.02,26.92 16.8,27.14 IC1.20 | JP21.2 53.34,30.48 53.34,26.67 52.32,25.65 52.32,23.62 51.31,22.61 51.05,22.61 48.51,20.07 | C3.A 42.16,8.51 | 45.58,8.27 C21.2 | 42.45,9.4 42.37,9.48 42.42,9.78 42.42,10.41 44.96,12.95 44.96,14.48 46.99,16.51 R8.2 47.61,15.64 48.01,15.24 | 44.2,20.07 48.51,20.07 | 48.01,15.24 49.28,15.24 49.78,15.75 49.78,19.56 49.28,20.07 48.51,20.07 | C22.2 47.61,14.84 48.01,15.24 | U4.1 30.04,6.67 30.23,6.86 30.23,8.38 30.34,8.27 | R24.2 58.93,8.78
  Top 0.305: 20.57,33.78 20.07,34.29 20.07,35.36 | 20.57,33.78 20.57,32.77 20.07,32.26 19.3,32.26 16.8,29.76 | F1.2 19.3,38.1 20.05,37.35 IC1.4 | R24.2 58.02,7.87 49.28,7.87 48.23,8.92 U2.3 46.99,9.21 | 20.57,33.78 22.1,33.78 22.74,34.42 22.74,35.44 23.11,35.81 25.4,35.81 25.4,37.34 26.16,38.1 27.94,38.1 JP7.4 29.21,39.12 31.75,36.58 31.75,34.8 32.51,34.04 36.45,34.04 38.23,32.26 C19.A 38.23,27.05 39.12,26.16 40.39,26.16 41.76,24.79 IC5.20 | 46.99,9.21 46.66,9.21 C21.2 | U2.1 47.43,11.11 46.99,10.67 46.99,9.21 | U4.3 30.04,8.57 30.23,8.38 | 30.34,8.27 C14.2 v31.5,9.4 | 44.2,9.4 v44.2,10.67 | X2.5 62.46,6.58 JP24.2 60.2,6.35 58.93,7.62 58.93,8.78 | IC1.20 16.8,29.68 | IC1.19 16.16,29.11 16.76,29.72
  Top 0.406: 39.37,4.83 JP10.7 39.37,5.08 42.16,7.87 42.16,8.51 | 42.37,9.48 C3.A | 45.58,8.27 44.45,9.4 44.2,9.4 42.45,9.4
  Bottom 0.254: JP21.2 JP22.2 56.9,31.75 57.4,32.26 57.4,37.34 58.17,38.1 60.96,38.1 U$7.2 65.28,39.37 66.55,38.1 69.85,38.1 JP2.2 69.34,35.05 69.34,33.53 68.83,33.02 66.29,33.02 65.79,32.51 65.79,31.75 v65.02,30.99 | v12.95,7.37 13.46,7.37 15.75,9.65 15.75,15.49 v16.76,16.51
  Bottom 0.305: v31.5,9.4 33.02,9.4 34.8,11.18 43.69,11.18 v44.2,10.67
#RST
  Top 0.305: IC1.2 21.36,39.13 JP7.1
AREF
  Top 0.305: JP18.6 22.1,3.3 22.1,5.84 JP4.1
AX
  Top 0.254: C10.1 21.96,13.18 U$1.12 23.16,13.76 23.88,14.48 25.91,14.48 26.67,13.72 27.43,13.72 30.23,16.51 30.23,19.05 31.82,20.64 IC5.5
AY
  Top 0.254: U$1.10 24.45,13.53 24.89,13.97 25.65,13.97 26.42,13.21 27.43,13.21 27.94,12.7 C11.1 28.7,12.84 28.7,14.22 30.73,16.26 30.73,18.8 31.93,20 IC5.6
AZ
  Top 0.254: U$1.8 27.22,12.4 28.19,11.43 C12.1 29.58,10.41 30.73,10.41 31.24,10.92 31.24,18.54 32.05,19.34 IC5.7
CH7  (via drill 0.51)
  Top 0.254: v40.13,24.13 39.88,24.13 37.08,21.34 37.08,19.81 35.97,18.7 IC5.8
  Bottom 0.254: v40.13,24.13 43.18,24.13 44.2,25.15 65.28,25.15 65.53,25.4 69.85,25.4 JP5.3
D+
  Top 0.254: X1.D+ 6.35,30.23 7.11,29.46 13.21,29.46 13.55,29.12 IC1.15
D-
  Top 0.254: X1.D- 7.15,30.44 7.62,29.97 13.46,29.97 14.21,29.23 IC1.16
GND  (via drill 0.51)
  Top 0.254: 19.3,18.54 19.32,18.53 U1.2 21.61,18.53 21.62,18.54 | 21.62,18.54 U1.8 21.62,15.01 21.59,14.99 21.59,14.73 | 21.62,18.54 U1.27 21.59,19.73 21.59,20.83 | 25.4,27.43 25.4,24.72 | 25.4,27.43 25.4,28.7 | 24.38,27.43 22.86,27.43 | 24.38,27.43 25.4,27.43 | U3.2 24.37,27.42 24.38,27.43 | 25.4,24.72 25.4,23.88 | 25.4,24.72 U3.8
  Top 0.406: U4.2 28.7,7.62 27.94,6.86 v27.94,5.08
  other vias: 40.13,18.8 29.97,13.97 27.43,14.99 12.45,3.56 32.77,18.29 15.75,32.26 36.32,31.24 20.57,12.7 68.83,3.05 54.61,12.95 26.92,11.18 46.23,22.86 42.67,13.97 59.94,10.41 65.53,37.34 58.42,33.02 50.29,20.32 23.62,34.04 49.28,22.86 32.51,15.75 34.04,25.4 29.72,29.46 21.84,20.83
  pour Top (isolate 0.305): 0,40.39 72.39,40.64 72.39,0 0,-0.25
  pour Bottom (isolate 0.305): 0,40.39 73.15,40.64 73.15,0 0,-0.25
MISO
  Top 0.254: U$7.1 60.96,38.1 62.99,38.1 65.79,35.31 65.79,33.02 64.26,31.5 62.23,31.5 61.21,30.48 61.21,28.7 59.69,27.18 59.69,25.4 60.33,24.77 U$4.8
MOSI
  Top 0.254: U$7.4 63.25,36.83 64.52,35.56 64.52,35.19 R11.1
MOSI/1.5
  Top 0.254: R11.2 64.77,32.77 64.01,32 61.98,32 60.45,30.48 60.45,29.32 R12.2 60.45,29.1 60.45,28.7 59.18,27.43 59.18,25.4 58.55,24.77 U$4.1
N$1
  Top 0.254: LED1.A 1.27,3.16 R5.1
N$2
  Top 0.254: R4.1 64.12,16.4 65.28,15.24 68.58,15.24 69.09,14.73 69.84,14.73 LED2.A
N$3
  Top 0.254: C8.1 29.21,24.13 28.96,23.88 27.69,23.88 27.43,24.13 U3.12
N$4
  Top 0.254: U3.15 30.32,25.42 C9.1
N$5
  Top 0.254: R10.1 64.77,29.21 66.04,30.48 69.33,30.48 LED3.A
N$6
  Top 0.254: R2.2 22.02,36.65
  Top 0.305: IC1.1 22,36.62 R2.2
N$7
  Top 0.254: R19.2 R15.2 53.35,22.23 U$4.3
N$8
  Top 0.254: U3.20 29.74,27.92 29.97,27.69 29.97,27.18 30.48,26.67 R3.2
N$9
  Top 0.254: U3.23 27.43,29.32 R7.1
N$10
  Top 0.254: IC2.7 IC2.8 R8.1
N$11
  Top 0.813: U$21.3 6.18,21 4.32,22.86 JP3.1
N$12
  Top 0.254: R1.2 25.03,20.94 25.4,20.57 25.4,19.14 U1.20
N$13
  Top 0.254: U1.6 19.68,16.53 C6.1
N$14
  Top 0.254: R14.2 R13.2 54.85,19.43 U$4.4
N$15
  Top 0.254: U1.1 20.44,20.82 R6.2
N$16
  Top 0.254: U1.12 23.62,15.24 23.88,14.99 25.77,14.99 C5.1
N$17
  Top 0.305: X1.VBUS 7.95,33.2 7.37,33.78 7.37,38.61 8.13,39.37 12.57,39.37 F1.1
N$18
  Top 0.254: U1.15 26.04,16.53 C7.1
N$20
  Top 0.254: C2.1 32.4,28.31 31.5,29.21 31.5,29.84 JP27.2
N$21
  Top 0.813: JP3.2 4.32,25.4 6.35,23.37 8.21,23.37 U$21.2
N$22
  Top 0.254: LED4.A 69.84,27.43 69.34,27.43 68.83,26.92 68.83,25.91 68.33,25.4 66.29,25.4 64.15,27.54 R21.1
N$23
  Top 0.254: C25.1 21.59,24.38 22.1,23.88 JP20.2
N$24  (via drill 0.51)
  Top 0.254: v19.56,25.4 18.75,26.2 IC1.23 | v65.28,27.94 68.33,27.94 68.83,28.45 69.84,28.45 LED3.C
  Bottom 0.254: v19.56,25.4 19.56,26.16 22.1,28.7 25.15,28.7 29.72,33.27 44.2,33.27 45.21,32.26 45.21,27.43 46.48,26.16 63.5,26.16 v65.28,27.94
N$25  (via drill 0.51)
  Top 0.254: v18.54,24.64 18.11,25.07 IC1.22 | v71.12,27.94 71.12,26.42 70.61,25.91 69.86,25.91 LED4.C
  Bottom 0.254: v71.12,27.94 66.8,27.94 64.52,25.65 46.23,25.65 44.7,27.18 44.7,32 43.94,32.77 29.97,32.77 25.4,28.19 22.35,28.19 20.57,26.42 20.57,25.15 19.81,24.38 18.8,24.38 v18.54,24.64
N$26
  Top 0.254: 64.12,14.08 R22.1 64.12,13.6 65.02,12.7 68.58,12.7 69.09,12.19 69.84,12.19 LED5.A
N$27
  Top 0.254: R23.1 64.12,18.68 65.02,17.78 69.33,17.78 LED6.A
N$28
  Top 0.813: JP3.3 5.84,27.94 U$21.1
N$29
  Top 0.254: JP25.2 27.3,19.07 C1.1
N$34
  Top 0.254: R28.1 2.54,13.97 JP6.2
N$36
  Top 0.254: JP6.1 R30.1
N$38
  Top 0.254: R32.1 2.54,11.43 JP16.3
N$40
  Top 0.254: R34.1 3.16,15.89 JP6.3
PB0  (via drill 0.51)
  Top 0.254: JP15.2 34.04,4.32 34.04,9.14 v34.54,9.65 | v57.66,19.05 R13.1
  Bottom 0.254: v34.54,9.65 35.05,9.65 36.07,10.67 41.4,10.67 42.42,9.65 56.39,9.65 57.66,10.92 v57.66,19.05
PC0
  Top 0.254: R22.2 JP12.8
PC1
  Top 0.254: R4.2 JP12.7
PC2
  Top 0.254: R23.2 JP12.6
PC3  (via drill 0.51)
  Top 0.254: IC5.16 42.85,20.64 v43.18,20.32
  Bottom 0.254: JP12.5 64.77,24.13 44.7,24.13 44.2,23.62 44.2,21.34 v43.18,20.32
PC4  (via drill 0.51)
  Top 0.254: IC5.18 43.03,21.95 v43.18,22.1
  Bottom 0.254: v43.18,22.1 43.18,23.37 44.45,24.64 65.02,24.64 65.53,24.13 JP12.4
PC6  (via drill 0.51)
  Top 0.254: R15.1 51.42,21.96 52.83,23.37 52.83,25.4 53.59,26.16 56.64,26.16 v57.66,27.18
  Bottom 0.254: JP12.2 65.28,29.21 64.26,28.19 64.26,27.69 63.25,26.67 58.17,26.67 v57.66,27.18
PC7  (via drill 0.51)
  Top 0.254: v46.99,29.67 47.3,29.67 47.75,29.21 U$8.2
  Bottom 0.254: JP12.1 65.28,29.72 65.02,29.72 63.75,28.45 63.75,27.94 62.99,27.18 59.18,27.18 58.17,28.19 57.15,28.19 55.63,26.67 49.99,26.67 v46.99,29.67
PD0  (via drill 0.51)
  Top 0.254: IC2.6 46.35,16.64 44.45,14.73 44.45,13.21 42.16,10.92 41.15,10.92 40.64,10.41 v40.64,8.64 | X2.3 64.27,4.58 63.5,3.81 63.5,2.54 JP24.4 60.96,2.54 54.1,2.54 53.59,3.05 52.83,3.05 JP10.2
  Bottom 0.254: JP10.2 52.07,4.83 48.77,8.13 41.15,8.13 v40.64,8.64
PD1  (via drill 0.51)
  Top 0.254: IC2.5 45.09,16.13 43.94,14.99 43.94,13.46 41.91,11.43 37.34,11.43 36.83,10.92 v36.83,9.14 | JP11.1 53.34,2.54 51.31,2.54 50.8,3.05 50.8,4.57 51.31,5.08 60.96,5.08 JP24.3 64,5.58 X2.4
  Bottom 0.254: JP11.1 53.34,2.54 53.34,4.32 49.02,8.64 41.91,8.64 40.89,9.65 37.34,9.65 v36.83,9.14
PD4  (via drill 0.51)
  Top 0.254: X2.1 67.1,2.58 v67.31,2.79
  Bottom 0.254: v67.31,2.79 67.31,4.32 66.55,5.08 61.47,5.08 60.96,4.57 60.96,3.05 60.45,2.54 55.88,2.54 JP10.1
PE0
  Top 0.254: R2.1 24.13,36.83 JP7.3
PE1  (via drill 0.51)
  Top 0.254: 19.41,33.38 v19.56,33.27 19.41,33.43 IC1.5
  Bottom 0.254: v19.56,33.27 19.56,34.8 JP7.2
PE6  (via drill 0.51)
  Top 0.254: v15.24,4.83 15.24,7.62 15.88,8.26 U$33.7 15.75,9.02 15.75,9.65 16,9.91 17.02,9.91 18.03,10.92 18.03,12.45 17.78,12.7 R25.2
  Bottom 0.254: v15.24,4.83 15.75,4.32 21.84,4.32 23.62,6.1 37.08,6.1 38.1,5.08 38.1,2.54 JP11.7
PE7  (via drill 0.51)
  Top 0.254: v13.72,4.83 14.48,5.59 14.48,8.76 U$33.8 14.61,9.78 15.24,10.41 16.14,10.41 R20.2
  Top 0.305: U$33.8 14.59,8.89
  Bottom 0.254: JP15.5 26.67,4.57 25.65,5.59 23.88,5.59 22.1,3.81 14.73,3.81 v13.72,4.83
PF0
  Top 0.254: R9.1 R35.P$2 5.59,15.49 5.33,15.24 R34.2
  Bottom 0.254: JP8.1 35.31,37.85 35.31,37.08 34.54,36.32 28.19,36.32 23.62,31.75 20.57,31.75 6.86,18.03 6.86,16.51 R35.P$2
PF1
  Top 0.254: R28.2 4.71,13.72 R29.P$2 R36.1
  Bottom 0.254: JP9.1 36.58,36.83 35.56,35.81 28.45,35.81 23.88,31.24 20.83,31.24 7.37,17.78 7.37,15.24 R29.P$2
PF2
  Top 0.254: R30.2 5.08,12.7 R31.P$2 R37.1
  Bottom 0.254: JP8.2 38.1,38.1 38.1,35.81 37.59,35.31 28.7,35.31 24.13,30.73 21.08,30.73 7.87,17.53 7.87,13.97 R31.P$2
PF3
  Top 0.254: R32.2 4.57,11.43 R33.P$2 R38.1
  Bottom 0.254: JP9.2 39.37,36.32 37.85,34.8 28.96,34.8 24.38,30.23 21.34,30.23 8.38,17.27 8.38,12.7 R33.P$2
PF4
  Bottom 0.254: JP8.3 40.64,38.1 40.64,36.07 38.86,34.29 29.21,34.29 24.64,29.72 21.59,29.72 8.89,17.02 8.89,12.45 7.11,10.67 7.11,9.65 6.35,8.89 2.54,8.89 JP16.2
PF5
  Bottom 0.254: JP9.3 41.91,36.58 39.12,33.78 29.46,33.78 24.89,29.21 21.84,29.21 9.4,16.76 9.4,12.19 7.62,10.41 7.62,9.4 6.6,8.38 3.3,8.38 2.54,7.62 2.54,6.35 JP16.1
PF6
  Bottom 0.254: JP21.3 50.8,34.29 50.04,35.05 44.2,35.05 43.18,36.07 43.18,38.1 JP8.4
PF7
  Bottom 0.254: JP22.3 53.34,35.56 45.72,35.56 JP9.4
PG0
  Top 0.254: JP13.2 S1.3 61.59,10.54 60.34,9.29 R24.1
  Bottom 0.254: JP13.2 62.48,11.43 59.69,8.64 JP23.2
PG1  (via drill 0.51)
  Top 0.254: S2.2 7.62,7.87 8.13,8.38 10.67,8.38 v11.43,9.14
  Bottom 0.254: v11.43,9.14 11.43,7.11 12.19,6.35 15.75,6.35 16.51,7.11 17.53,7.11 17.78,7.37 21.84,7.37 22.61,8.13 35.56,8.13 35.81,8.38 35.81,9.65 36.32,10.16 41.15,10.16 42.16,9.14 56.64,9.14 60.71,13.21 65.53,13.21 JP13.1
PH0
  Top 0.254: JP18.4 30.48,2.54 30.48,4.57 30.99,5.08 32.51,5.08 33.02,5.59 33.02,13.97 34.29,15.24 37.85,15.24 39.12,16.51 39.12,19.56 39.55,20 IC5.15
PH1
  Top 0.254: IC5.17 39.33,21.3 38.61,20.57 38.61,16.76 37.59,15.75 34.04,15.75 32.51,14.22 32.51,6.1 32,5.59 30.73,5.59 29.34,4.19 29.21,4.06 JP15.4
PH2  (via drill 0.51)
  Top 0.254: JP18.3 33.02,2.54 33.02,4.57 33.53,5.08 33.53,13.72 34.04,14.22 v35.05,14.22 | IC5.19 39.87,22.59 38.1,20.83 38.1,17.78 v37.59,17.27
  Bottom 0.254: v37.59,17.27 37.59,16.76 v35.05,14.22
PJ0
  Top 0.254: JP14.3 68.58,34.29 JP2.4
PJ1
  Top 0.254: JP14.2 68.58,36.83 JP2.3
PL2  (via drill 0.51)
  Top 0.254: U$21.5 12.46,17.8 v12.45,17.78
  Bottom 0.254: JP10.5 44.45,5.08 42.93,6.6 23.37,6.6 21.59,4.83 16.76,4.83 15.75,5.84 11.94,5.84 10.92,6.86 10.92,8.38 10.41,8.89 10.41,9.65 11.18,10.41 11.18,16.76 v12.45,17.78
PL6  (via drill 0.51)
  Top 0.254: U$33.6 17.14,8.26 17.02,8.13 v17.02,6.1 | U$33.6 17.02,9.02 17.02,9.14 18.54,10.67 18.54,12.7 17.78,13.46 17.67,13.46 R26.2 | U$33.6 17.27,9.02
  Bottom 0.254: JP10.3 49.53,5.84 48.26,7.11 23.11,7.11 21.34,5.33 17.78,5.33 v17.02,6.1
PL7  (via drill 0.51)
  Top 0.254: v18.54,6.35 18.41,6.48 U$33.5 18.41,9.78 19.05,10.41 19.05,12.95 18.03,13.97 18.03,14.37 R27.2
  Bottom 0.254: JP11.2 50.8,2.54 50.8,5.33 48.51,7.62 22.86,7.62 21.59,6.35 v18.54,6.35
RST  (via drill 0.51)
  Top 0.305: S3.3 34.29,35.56 35.05,34.8 41.91,34.8 v42.16,34.54
  Bottom 0.254: v42.16,34.54 49.78,34.54 50.8,33.53 50.8,31.24 51.56,30.48 58.42,30.48 59.69,31.75 U$7.5
SCK
  Top 0.254: R17.1 59.07,37.48 U$7.3
SCK/1.5
  Top 0.254: R18.2 R17.2 | R18.2 57.26,33.78 | U$4.2 53.72,23.5 53.34,23.88 53.34,25.15 53.85,25.65 57.91,25.65 58.67,26.42 58.67,27.43 57.91,28.19 57.15,28.19 56.64,28.7 56.64,30.99 56.13,31.5 56.13,32.77 56.9,33.53 57.01,33.53 R18.2
SCL1
  Top 0.254: R43.1 U$8.6 45.72,29.21 46.23,28.7 46.23,25.91 46.35,25.78 IC2.3
SDA1
  Top 0.254: U$8.7 44.92,27.72 | U$8.7 R42.1 | IC2.4 45.09,27.78 U$8.7
TEMP
  Top 0.254: IC5.4 35.52,21.3 35.81,21.59 35.81,26.16 33.78,28.19 33.78,29.97 32.77,30.99 28.08,30.99 R7.2 27.8,30.99 27.18,30.99 26.67,30.48 C26.1
WP
  Top 0.254: U$4.5 62.12,20.77 | 64.75,20.95 R16.1
  Top 0.305: U$4.5 64.75,20.95
XOUT
  Top 0.254: IC5.2 34.43,22.61 25.4,22.61 24.89,23.11 23.48,23.11 23.11,22.75 23.11,22.35 22.86,22.1 JP20.1 21.96,22.24 R6.1
YOUT
  Top 0.254: R1.1 25,22.24 25.3,21.95 28.19,21.95 | 28.19,21.95 IC5.3 | 28.19,21.95 JP25.1
ZOUT
  Top 0.254: IC5.1 35.31,24.11 35.31,25.91 34.54,26.67 | R3.1 34.54,26.67 | JP27.1 32.77,29.97 33.27,29.46 33.27,27.94 34.54,26.67

### Text on the board
tPlace: FUSE | TelemPort | RST | Pressure | GYRO-Z | Sensor | USB | Expansion | TX | 10uF | DF | ADC 12Bits | Ports | RX | FTDI | Pitot | Relay | SW1 | 10uF | C | GYRO-XY | 10uF | I2C Traslator | B | DOWN=LOW | Accel | 47uF Cap | A | Volt | Dividers | Analog 3.3V | Front | 3.3V | Digital 3.3V | SW1 | VRef | I2C Port | NO GPS! | 0 | 1 | ON | SW2
bPlace: AVR-ISP | DTR | TXO | RXI | +5V | CTS | GND | GND | +5V | AN6 | AN7 | OUT | +5V | +5V | IN | GND | GND | 1 | PL2(47) | Relay | IN | 0 | GND | +5V | AN0 | GND | HOTEL1.0 | AN1 | AN2 | AN3 | 8/19/2010 | AN4 | GND | AN5 | +5V | +3.3V | PD2/PD3 | SW1 | PG0(41) | =) | SDA | SCL